# Altium schematic sheet STM32.SchDoc
size A3; SheetNumber: 3; SheetTotal: 3
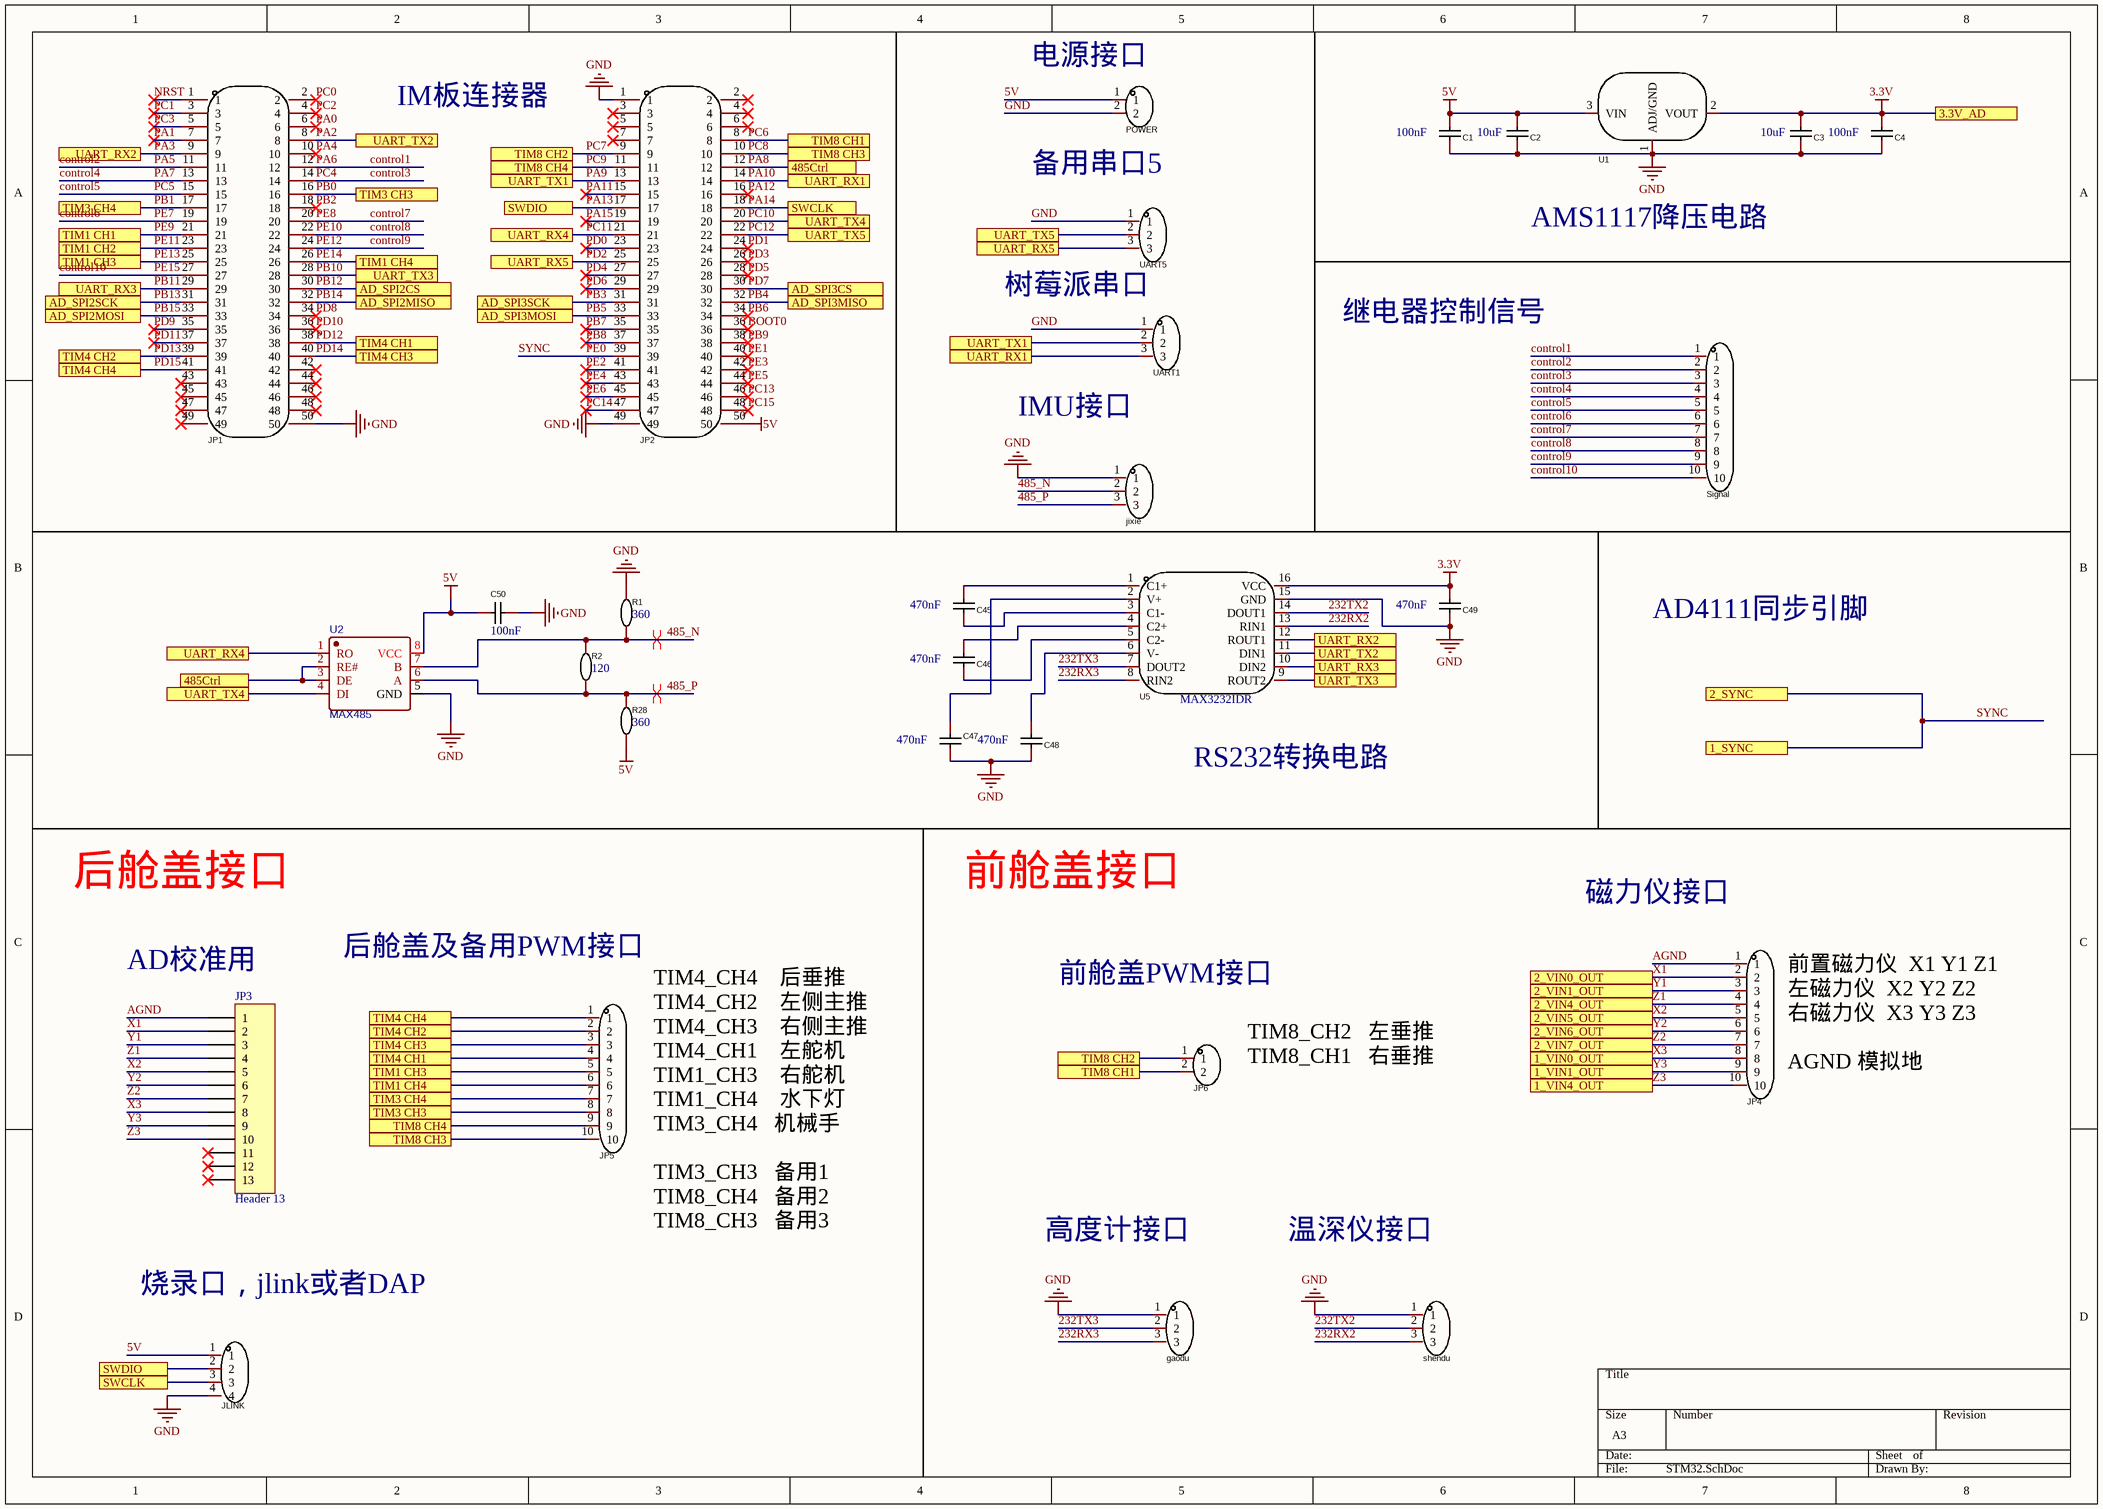
[diagram p0: STM32.SchDoc]

## Parts
C1  100nF  [C0603]
C2  10uF  [C0603]
C3  10uF  [C0603]
C4  100nF  [C0603]
C45  470nF  [C0603]
C46  470nF  [C0603]
C47  470nF  [C0603]
C48  470nF  [C0603]
C49  470nF  [C0603]
C50  100nF  [C0603]
gaodu  KF2EDGR-3.81-3P  [CONN-TH_3P-P3.81_KF2EDGR-3.81-3P]  (value not drawn)
jixie  KF2EDGR-3.81-3P  [CONN-TH_3P-P3.81_KF2EDGR-3.81-3P]  (value not drawn)
JLINK  XH-4AW  [CONN-TH_XH-4AW]  (value not drawn)
JP1  2685Y-225CNG1SNA01  [HDR-TH_50P-P2.54-V-F-R2-C25-S2.54-1]  (value not drawn)
JP2  2685Y-225CNG1SNA01  [HDR-TH_50P-P2.54-V-F-R2-C25-S2.54-1]  (value not drawn)
JP3  Header 13  [HDR1X13]
JP4  KF2EDGR-3.5-10P  [CONN-TH_10P-P3.50_KF2EDGR-3.5-10P]  (value not drawn)
JP5  KF2EDGR-3.5-10P  [CONN-TH_10P-P3.50_KF2EDGR-3.5-10P]  (value not drawn)
JP6  KF2EDGR-3.81-2P  [CONN-TH_2P-P3.81_KF2EDGR-3.81-2P]  (value not drawn)
POWER  KF2EDGR-3.81-2P  [CONN-TH_2P-P3.81_KF2EDGR-3.81-2P]  (value not drawn)
R1  360  [R0603]
R2  120  [R0603]
R28  360  [R0603]
shendu  KF2EDGR-3.81-3P  [CONN-TH_3P-P3.81_KF2EDGR-3.81-3P]  (value not drawn)
Signal  KF2EDGR-3.5-10P  [CONN-TH_10P-P3.50_KF2EDGR-3.5-10P]  (value not drawn)
U1  A1117-3.3  [SOT-223-3_L6.5-W3.4-P2.30-LS7.0-BR-1]  (value not drawn)
U2  MAX485  [SOIC-8_150MIL]
U5  MAX3232IDR  [SOIC-16_L9.9-W3.9-P1.27-LS6.0-BL]
UART1  KF2EDGR-3.81-3P  [CONN-TH_3P-P3.81_KF2EDGR-3.81-3P]  (value not drawn)
UART5  KF2EDGR-3.81-3P  [CONN-TH_3P-P3.81_KF2EDGR-3.81-3P]  (value not drawn)

## Ports
1_SYNC, 1_VIN0_OUT, 1_VIN1_OUT, 1_VIN4_OUT, 2_SYNC, 2_VIN0_OUT, 2_VIN1_OUT, 2_VIN4_OUT, 2_VIN5_OUT, 2_VIN6_OUT, 2_VIN7_OUT, 3.3V_AD, 485Ctrl, AD_SPI2CS, AD_SPI2MISO, AD_SPI2MOSI, AD_SPI2SCK, AD_SPI3CS, AD_SPI3MISO, AD_SPI3MOSI, AD_SPI3SCK, SWCLK, SWDIO, TIM1 CH1, TIM1 CH2, TIM1 CH3, TIM1 CH4, TIM3 CH3, TIM3 CH4, TIM4 CH1, TIM4 CH2, TIM4 CH3, TIM4 CH4, TIM8 CH1, TIM8 CH2, TIM8 CH3, TIM8 CH4, UART_RX1, UART_RX2, UART_RX3, UART_RX4, UART_RX5, UART_TX1, UART_TX2, UART_TX3, UART_TX4, UART_TX5

## Nets
3.3V: C3.2 C4.2 C49.2 U1.2(VOUT) U5.16(VCC) ; port 3.3V_AD
5V: C1.1 C2.1 C50.2 JLINK.1 JP2.50 POWER.1 R28.1 U1.3(VIN) U2.8(VCC)
GND: C1.2 C2.2 C3.1 C4.1 C47.1 C48.1 C49.1 C50.1 gaodu.1 jixie.1 JLINK.4 JP1.50 JP2.1 JP2.49 POWER.2 R1.2 shendu.1 U1.1(ADJ/GND) U2.5(GND) U5.15(GND) UART1.1 UART5.1
232RX2: shendu.3 U5.13(RIN1)
232RX3: gaodu.3 U5.8(RIN2)
232TX2: shendu.2 U5.14(DOUT1)
232TX3: gaodu.2 U5.7(DOUT2)
485_N: jixie.2 R1.1 R2.2 U2.7(B)
485_P: jixie.3 R2.1 R28.2 U2.6(A)
AGND: JP3.1 JP4.1
BOOT0: JP2.36
control1: JP1.12 Signal.1  [also labelled PA6]
control2: JP1.11 Signal.2  [also labelled PA5]
control3: JP1.14 Signal.3  [also labelled PC4]
control4: JP1.13 Signal.4  [also labelled PA7]
control5: JP1.15 Signal.5  [also labelled PC5]
control6: JP1.19 Signal.6  [also labelled PE7]
control7: JP1.20 Signal.7  [also labelled PE8]
control8: JP1.22 Signal.8  [also labelled PE10]
control9: JP1.24 Signal.9  [also labelled PE12]
control10: JP1.27 Signal.10  [also labelled PE15]
NRST: JP1.1
PA0: JP1.6
PA1: JP1.7
PA2: JP1.8 U5.11(DIN1) ; port UART_TX2
PA3: JP1.9 U5.12(ROUT1) ; port UART_RX2
PA4: JP1.10
PA8: JP2.12 U2.2(RE#) U2.3(DE) ; port 485Ctrl
PA9: JP2.13 UART1.2 ; port UART_TX1
PA10: JP2.14 UART1.3 ; port UART_RX1
PA11: JP2.15
PA12: JP2.16
PA13: JLINK.2 JP2.17 ; port SWDIO
PA14: JLINK.3 JP2.18 ; port SWCLK
PA15: JP2.19
PB0: JP1.16 JP5.8 ; port TIM3 CH3
PB1: JP1.17 JP5.7 ; port TIM3 CH4
PB2: JP1.18
PB3: JP2.31 ; port AD_SPI3SCK
PB4: JP2.32 ; port AD_SPI3MISO
PB5: JP2.33 ; port AD_SPI3MOSI
PB6: JP2.34
PB7: JP2.35
PB8: JP2.37
PB9: JP2.38
PB10: JP1.28 U5.9(ROUT2) ; port UART_TX3
PB11: JP1.29 U5.10(DIN2) ; port UART_RX3
PB12: JP1.30 ; port AD_SPI2CS
PB13: JP1.31 ; port AD_SPI2SCK
PB14: JP1.32 ; port AD_SPI2MISO
PB15: JP1.33 ; port AD_SPI2MOSI
PC0: JP1.2
PC1: JP1.3
PC2: JP1.4
PC3: JP1.5
PC6: JP2.8 JP6.2 ; port TIM8 CH1
PC7: JP2.9 JP6.1 ; port TIM8 CH2
PC8: JP2.10 JP5.10 ; port TIM8 CH3
PC9: JP2.11 JP5.9 ; port TIM8 CH4
PC10: JP2.20 U2.4(DI) ; port UART_TX4
PC11: JP2.21 U2.1(RO) ; port UART_RX4
PC12: JP2.22 UART5.2 ; port UART_TX5
PC13: JP2.46
PC14: JP2.47
PC15: JP2.48
PD0: JP2.23
PD1: JP2.24
PD2: JP2.25 UART5.3 ; port UART_RX5
PD3: JP2.26
PD4: JP2.27
PD5: JP2.28
PD6: JP2.29
PD7: JP2.30 ; port AD_SPI3CS
PD8: JP1.34
PD9: JP1.35
PD10: JP1.36
PD11: JP1.37
PD12: JP1.38 JP5.4 ; port TIM4 CH1
PD13: JP1.39 JP5.2 ; port TIM4 CH2
PD14: JP1.40 JP5.3 ; port TIM4 CH3
PD15: JP1.41 JP5.1 ; port TIM4 CH4
PE0: JP2.39 ; port 2_SYNC, port 1_SYNC  [also labelled SYNC]
PE1: JP2.40
PE2: JP2.41
PE3: JP2.42
PE4: JP2.43
PE5: JP2.44
PE6: JP2.45
PE9: JP1.21 ; port TIM1 CH1
PE11: JP1.23 ; port TIM1 CH2
PE13: JP1.25 JP5.5 ; port TIM1 CH3
PE14: JP1.26 JP5.6 ; port TIM1 CH4
X1: JP3.2 JP4.2 ; port 2_VIN0_OUT
X2: JP3.5 JP4.5 ; port 2_VIN5_OUT
X3: JP3.8 JP4.8 ; port 1_VIN0_OUT
Y1: JP3.3 JP4.3 ; port 2_VIN1_OUT
Y2: JP3.6 JP4.6 ; port 2_VIN6_OUT
Y3: JP3.9 JP4.9 ; port 1_VIN1_OUT
Z1: JP3.4 JP4.4 ; port 2_VIN4_OUT
Z2: JP3.7 JP4.7 ; port 2_VIN7_OUT
Z3: JP3.10 JP4.10 ; port 1_VIN4_OUT
NetC45_1: C45.1 U5.3(C1-)
NetC45_2: C45.2 U5.1(C1+)
NetC46_1: C46.1 U5.5(C2-)
NetC46_2: C46.2 U5.4(C2+)
NetC47_2: C47.2 U5.2(V+)
NetC48_2: C48.2 U5.6(V-)

Not connected (* = marked no-connect by the designer): JP1 42* 43* 44* 45* 46* 47* 48* 49*; JP2 2* 3* 4* 5* 6* 7*; JP3 11* 12* 13*

## Layout directives
differential pair: 485_N, 485_P

## Notes on the sheet
- IM板连接器
- (near POWER) 电源接口
- 备用串口5
- AMS1117降压电路
- 树莓派串口
- 继电器控制信号
- IMU接口
- AD4111同步引脚
- RS232转换电路
- 后舱盖接口
- 前舱盖接口
- 磁力仪接口
- (near JP3) AD校准用
- 后舱盖及备用PWM接口
- 前舱盖PWM接口
- TIM8_CH2   左垂推
  TIM8_CH1   右垂推
- (near JP4) 前置磁力仪  X1 Y1 Z1
  左磁力仪  X2 Y2 Z2
  右磁力仪  X3 Y3 Z3
  AGND 模拟地
- TIM4_CH4    后垂推
  TIM4_CH2    左侧主推
  TIM4_CH3    右侧主推
  TIM4_CH1    左舵机
  TIM1_CH3    右舵机
  TIM1_CH4    水下灯
  TIM3_CH4   机械手
  TIM3_CH3   备用1
  TIM8_CH4   备用2
  TIM8_CH3   备用3
- 高度计接口
- 温深仪接口
- 烧录口，jlink或者DAP

## Library data of the parts
C1 C4 C50 = 0603B104K500NT: 0603电容; Manufacturer: FH(风华); Add into BOM: yes; Tolerance: ±10%; Voltage Rated: 50V; Temperature Coefficient: X7R; Name: 100nF; Symbol: 0603B104K500NT; Device: 0603B104K500NT; LCSC Part Name: 100nF ±10% 50V; Supplier Part: C30926; Manufacturer Part: 0603B104K500NT; Supplier Footprint: 0603; JLCPCB Part Class: Extended Part; Datasheet: https://atta.szlcsc.com/upload/public/pdf/source/20170923/C30926_1506149436298988724.pdf; Supplier: LCSC; Convert to PCB: yes; Value: 100nF
C2 C3 C45-C49 = 0603B104K500NT: 0603电容; Manufacturer: FH(风华); Name: 100nF; Add into BOM: yes; Value: 100nF; Tolerance: ±10%; Voltage Rated: 50V; Temperature Coefficient: X7R; Symbol: 0603B104K500NT; Device: 0603B104K500NT; LCSC Part Name: 100nF ±10% 50V; Supplier Part: C30926; Manufacturer Part: 0603B104K500NT; Supplier Footprint: 0603; JLCPCB Part Class: Extended Part; Datasheet: https://atta.szlcsc.com/upload/public/pdf/source/20170923/C30926_1506149436298988724.pdf; Supplier: LCSC; Convert to PCB: yes
gaodu jixie shendu UART1 UART5 = KF2EDGR-3.81-3P: Manufacturer: KEFA(科发); Add into BOM: yes; Connector Type: 板端/插座-闭口; Pitch: 3.81mm; Number of PINs Per Row: 3; Current Rating (Max): 8A; Voltage Rating (Max): 300V; Name: KF2EDGR-3.81-3P; Symbol: KF2EDGR-3.81-3P; Device: KF2EDGR-3.81-3P; LCSC Part Name: 板端/插座-闭口 3.81mm 排数:1 每排P数:3 弯针; Supplier Part: C441183; Manufacturer Part: KF2EDGR-3.81-3P; Supplier Footprint: P=3.81mm; JLCPCB Part Class: Extended Part; Datasheet: https://atta.szlcsc.com/upload/public/pdf/source/20191023/C441183_0DEFA45C98AD039C055774507C9A3105.pdf; Supplier: LCSC; Convert to PCB: yes; Number of Rows: 1; Mounting Style: 弯针; Wire Gauge - AWG: -; Wire Gauge - mm?: -; Operating Temperature Range: -40℃~+105℃; Color: 绿色
JLINK = XH-4AW: XH2.54-4P弯针; Manufacturer: HCTL(华灿天禄); Symbol: XH-4AW_C2908613; Add into BOM: yes; Pins Structure: 1x4P; Pitch: 2.54mm; Reference Series: XH; Number of PINs Per Row: 4; Current Rating (Max): 3A; Name: XH-4AW; Device: XH-4AW; LCSC Part Name: 1x4P 间距:2.54mm 弯插 系列:XH; Supplier Part: C2908613; Manufacturer Part: XH-4AW; Supplier Footprint: 弯插,P=2.54mm; JLCPCB Part Class: Extended Part; Datasheet: https://atta.szlcsc.com/upload/public/pdf/source/20230711/B565BAF3B11666EF6B81B3605408F2BD.pdf; Supplier: LCSC; Convert to PCB: yes; Mounting Style: 弯插; Number of Pins: 4P; Number of Rows: 1; Row Spacing: -; Contact Material: 黄铜; Contact Plating: 锡; Operating Temperature Range: -25℃~+85℃
JP1 JP2 = 2685Y-225CNG1SNA01: Manufacturer: 华宇创; Add into BOM: yes; Number of Holes: 50P; Pitch: 2.54mm; Holes Structure: 2x25P; Name: 2685Y-225CNG1SNA01; Symbol: 2685Y-225CNG1SNA01; Device: 2685Y-225CNG1SNA01; LCSC Part Name: 2.54mm 2x25P Y型//环保耐高温/镀金; Supplier Part: C350296; Manufacturer Part: 2685Y-225CNG1SNA01; Supplier Footprint: 插件,P=2.54mm; JLCPCB Part Class: Extended Part; Datasheet: https://atta.szlcsc.com/upload/public/pdf/source/20181220/C350296_D2530F60C4B7AD26B2D0A354C76F8429.pdf; Supplier: LCSC; Convert to PCB: yes; Number of Rows: 双排; Row Spacing: 2.54mm; Mounting Type: 直插; Insulation Height: -; Contact Material: 黄铜; Contact Plating: -
JP3 = Header 13: Header, 13-Pin; LatestRevisionDate: 17-Jul-2002; LatestRevisionNote: Re-released for DXP Platform.; Publisher: Altium Limited
JP4 JP5 Signal = KF2EDGR-3.5-10P: Manufacturer: KEFA(科发); Add into BOM: yes; Connector Type: 板端/插座-闭口; Structure: 1x10P; Pitch: 3.5mm; Number of PINs Per Row: 10; Current Rating (Max): 8A; Voltage Rating (Max): 300V; Name: KF2EDGR-3.5-10P; Symbol: KF2EDGR-3.5-10P; Device: KF2EDGR-3.5-10P; LCSC Part Name: 3.5mm 1x10P 排数:1 每排P数:10; Supplier Part: C441168; Manufacturer Part: KF2EDGR-3.5-10P; Supplier Footprint: 弯插,P=3.5mm; JLCPCB Part Class: Extended Part; Datasheet: https://atta.szlcsc.com/upload/public/pdf/source/20230331/72E4E5AAB7D73656319D871C62219080.pdf; Supplier: LCSC; Convert to PCB: yes; Color: 绿色; Mounting Style: 弯针; Number of Pins: 10P; Number of Rows: 1; Operating Temperature Range: -40℃~+105℃
JP6 POWER = KF2EDGR-3.81-2P: Manufacturer: KEFA(科发); Add into BOM: yes; Connector Type: 板端/插座-闭口; Structure: 1x2P; Pitch: 3.81mm; Number of PINs Per Row: 2; Current Rating (Max): 8A; Voltage Rating (Max): 300V; Name: KF2EDGR-3.81-2P; Symbol: KF2EDGR-3.81-2P; Device: KF2EDGR-3.81-2P; LCSC Part Name: 板端/插座-闭口 1x2P 3.81mm 排数:1 每排P数:2 弯针; Supplier Part: C441182; Manufacturer Part: KF2EDGR-3.81-2P; Supplier Footprint: 弯插,P=3.81mm; JLCPCB Part Class: Extended Part; Datasheet: https://atta.szlcsc.com/upload/public/pdf/source/20230331/6258E6C6BF04EFF922F3E5A9E72A4547.pdf; Supplier: LCSC; Convert to PCB: yes; Number of Rows: 1; Mounting Style: 弯针; Operating Temperature Range: -40℃~+105℃; Color: 绿色
R1 R2 R28 = 0603WAF1002T5E: 0603电阻; Manufacturer: UNI-ROYAL(厚声); Name: 10kΩ; Add into BOM: yes; Value: 10kΩ; Tolerance: ±1%; Power(Watts): 100mW; Temperature Coefficient: ±100ppm/℃; Overload Voltage (Max): 75V; Symbol: 0603WAF1002T5E; Device: 0603WAF1002T5E; LCSC Part Name: 厚膜电阻 10kΩ ±1% 100mW; Supplier Part: C25804; Manufacturer Part: 0603WAF1002T5E; Supplier Footprint: 0603; JLCPCB Part Class: Basic Part; Datasheet: https://atta.szlcsc.com/upload/public/pdf/source/20200306/C422600_1E6D84923E4A46A82E41ADD87F860B5C.pdf; Supplier: LCSC; Convert to PCB: yes; Type: 厚膜电阻; Operating Temperature Range: -55℃~+155℃
U1 = AMS1117-3.3: Manufacturer: IDCHIP(英锐芯); Add into BOM: yes; Name: A1117-3.3; Symbol: A1117-3.3; Device: A1117-3.3; LCSC Part Name: AMS1117-3.3; Supplier Part: C7432020; Manufacturer Part: A1117-3.3; Supplier Footprint: SOT-223; Datasheet: https://atta.szlcsc.com/upload/public/pdf/source/20230625/435FEEFA02C0FE449E7397A11F8448E0.pdf; Supplier: LCSC; Convert to PCB: yes; link: https://atta.szlcsc.com/upload/public/pdf/source/20230625/435FEEFA02C0FE449E7397A11F8448E0.pdf
U2 = MAX3485ESA+T C18148: 485芯片; BOM_Manufacturer: MAXIM; SMT Type: Extend; BOM_Supplier: LCSC; BOM_Manufacturer Part: MAX3485ESA+T; image: //image.lceda.cn/szlcsc/C18148.jpg; BOM_Supplier Part: C18148; BOM_LCSC Assembly: Yes; spicePre: U; URL: https://item.szlcsc.com/18840.html
U5 = MAX3232IDR: Manufacturer: TI(德州仪器); Add into BOM: yes; Types: 收发器; Driver/receiver: 2/2; Data Rate: 250Kbps; Supply Voltage: 3V~5.5V; Name: MAX3232IDR; Symbol: MAX3232IDR; Device: MAX3232IDR; LCSC Part Name: MAX3232IDR; Supplier Part: C18261; Manufacturer Part: MAX3232IDR; Supplier Footprint: SOIC-16; JLCPCB Part Class: Extended Part; Datasheet: https://atta.szlcsc.com/upload/public/pdf/source/20130907/1457706645949.pdf; Supplier: LCSC; Convert to PCB: yes